# Altium schematic sheet BMP180.schdoc
size 74 x 40 mm
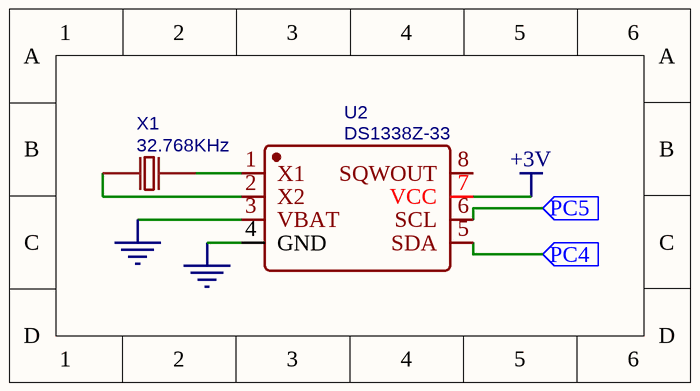
[diagram p0: BMP180.schdoc]

## Parts
U2  DS1338Z-33  [SOP-8_150MIL]
X1  32.768KHz  [3*8]

## Ports
PC4 (in), PC5 (in)

## Nets
+3V: U2.7(VCC)
GND: U2.3(VBAT) U2.4(GND)
PC4: U2.5(SDA) ; port PC4
PC5: U2.6(SCL) ; port PC5
NetU2_1: U2.1(X1) X1.2
NetU2_2: U2.2(X2) X1.1

Not connected (* = marked no-connect by the designer): U2 8(SQWOUT)

## Library data of the parts
U2 = DS1338Z-33: BOM_Manufacturer: MAXIM; BOM_Supplier: LCSC; BOM_Manufacturer Part: DS1338Z-33; spicePre: U; BOM_Supplier Part: C49105
X1 = 32.768KHz: BOM_Manufacturer: KDS; BOM_Manufacturer Part: DT-38 32.768KHz; Value: 32.768KHz; BOM_Supplier: LCSC; spicePre: X; BOM_Supplier Part: C93228